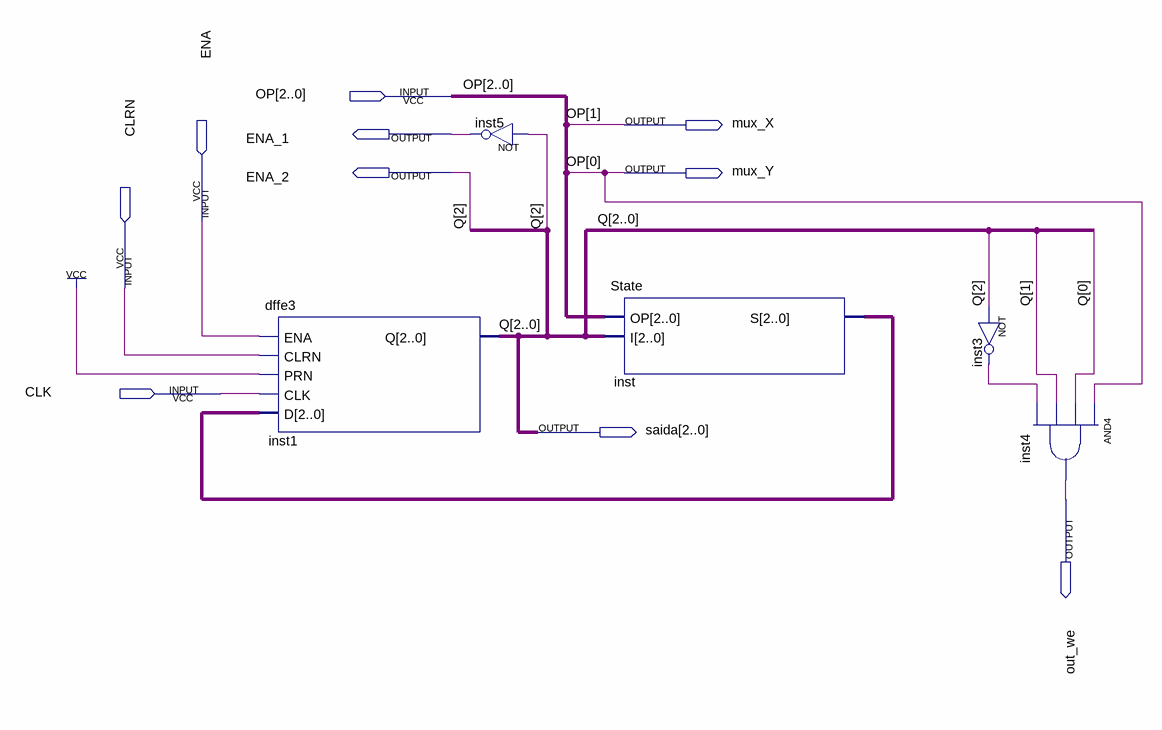
[diagram p0: schematic sheet]
// Quartus schematic CentralControl.bdf as structural Verilog: 5 symbols, 10 pins
module CentralControl (
  input  [2:0] OP,
  input  ENA,
  input  CLRN,
  input  CLK,
  output mux_X,
  output ENA_1,
  output ENA_2,
  output mux_Y,
  output [2:0] saida,
  output out_we
);

  wire inst3_out;
  wire [2:0] inst_s;

  dffe3 inst1 (.ENA(ENA), .CLRN(CLRN), .PRN(1'b1), .CLK(CLK), .D(inst_s), .Q({ENA_2, saida[1:0]}));
  not inst5 (ENA_1, ENA_2);
  State inst (.OP(OP), .I({ENA_2, saida[1:0]}), .S(inst_s));
  not inst3 (inst3_out, ENA_2);
  and inst4 (out_we, OP[0], saida[0], saida[1], inst3_out);

  assign mux_X = OP[1];
  assign mux_Y = OP[0];
  assign saida[2] = ENA_2;

  // Other names for the same wires on the sheet: Q[2:0] = {ENA_2, saida[1:0]}
endmodule
